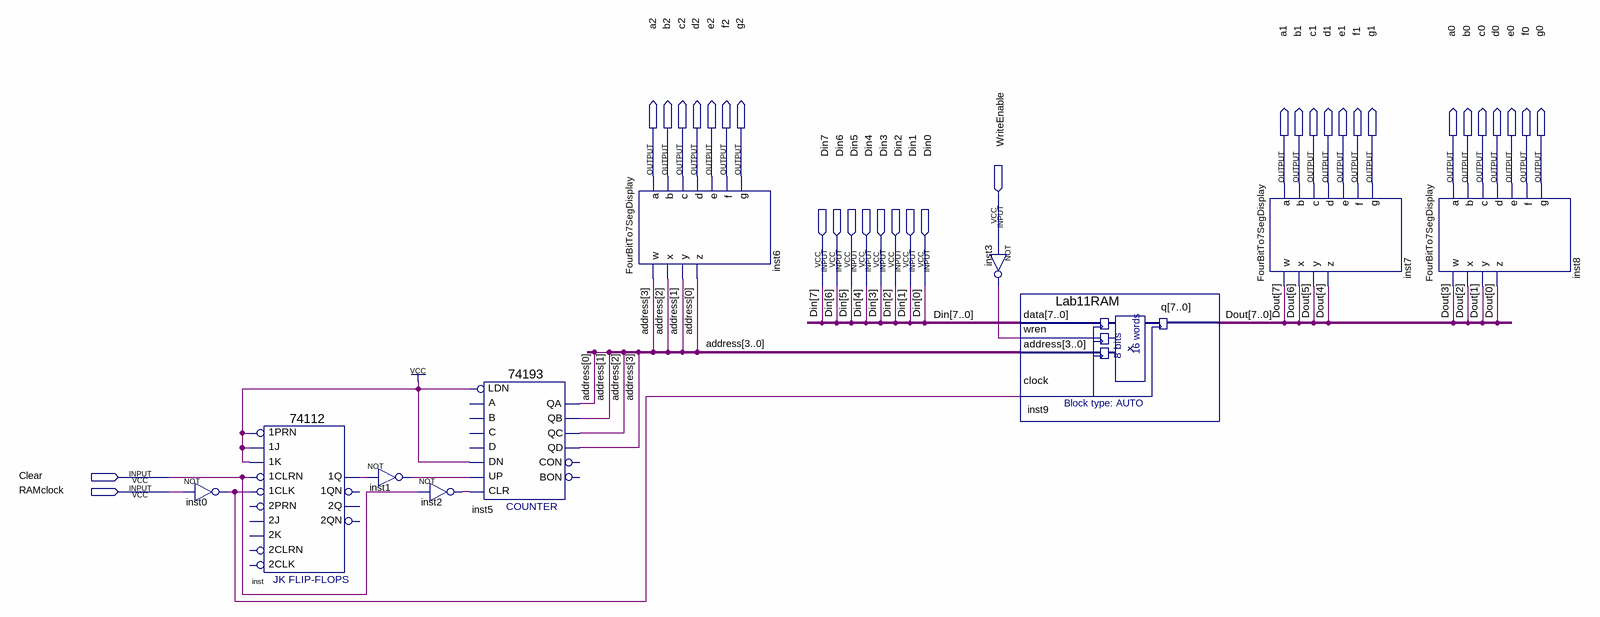
[diagram p0: schematic sheet]
// Quartus schematic Lab11.bdf as structural Verilog: 10 symbols, 32 pins
module Lab11 (
  input  WriteEnable,
  input  Din7,
  input  Din6,
  input  Din5,
  input  Din4,
  input  Din3,
  input  Din2,
  input  Din1,
  input  Din0,
  input  Clear,
  input  RAMclock,
  output a2,
  output b2,
  output c2,
  output d2,
  output e2,
  output f2,
  output g2,
  output a1,
  output b1,
  output c1,
  output d1,
  output e1,
  output f1,
  output g1,
  output a0,
  output b0,
  output c0,
  output d0,
  output e0,
  output f0,
  output g0
);

  wire inst0_out, inst1_out, inst2_out, inst3_out, inst_1q;
  wire [3:0] address;
  wire [7:0] Dout;

  not inst0 (inst0_out, RAMclock);
  \74112  inst (
    .\1K (1'b1), .\1J (1'b1), .\1PRN (1'b1), .\1CLK (inst0_out), .\1CLRN (Clear), .\1Q (inst_1q));  // open: 2K, 2J, 2PRN, 2CLK, 2CLRN, 1QN, 2Q, 2QN
  not inst1 (inst1_out, inst_1q);
  \74193  inst5 (
    .CLR(inst2_out), .UP(inst1_out), .DN(1'b1), .LDN(1'b1), .QB(address[1]), .QA(address[0]),
    .QD(address[3]), .QC(address[2]));  // open: D, C, B, A, CON, BON
  not inst2 (inst2_out, Clear);
  FourBitTo7SegDisplay inst6 (
    .w(address[3]), .x(address[2]), .y(address[1]), .z(address[0]), .a(a2), .b(b2), .c(c2), .d(d2), .e(e2),
    .f(f2), .g(g2));
  not inst3 (inst3_out, WriteEnable);
  Lab11RAM inst9 (
    .data({Din7, Din6, Din5, Din4, Din3, Din2, Din1, Din0}), .wren(inst3_out), .address(address),
    .clock(inst0_out), .q(Dout));
  FourBitTo7SegDisplay inst7 (
    .w(Dout[7]), .x(Dout[6]), .y(Dout[5]), .z(Dout[4]), .a(a1), .b(b1), .c(c1), .d(d1), .e(e1), .f(f1), .g(g1));
  FourBitTo7SegDisplay inst8 (
    .w(Dout[3]), .x(Dout[2]), .y(Dout[1]), .z(Dout[0]), .a(a0), .b(b0), .c(c0), .d(d0), .e(e0), .f(f0), .g(g0));
endmodule
